# EAGLE design 18f45502 (EAGLE 7.1.0)
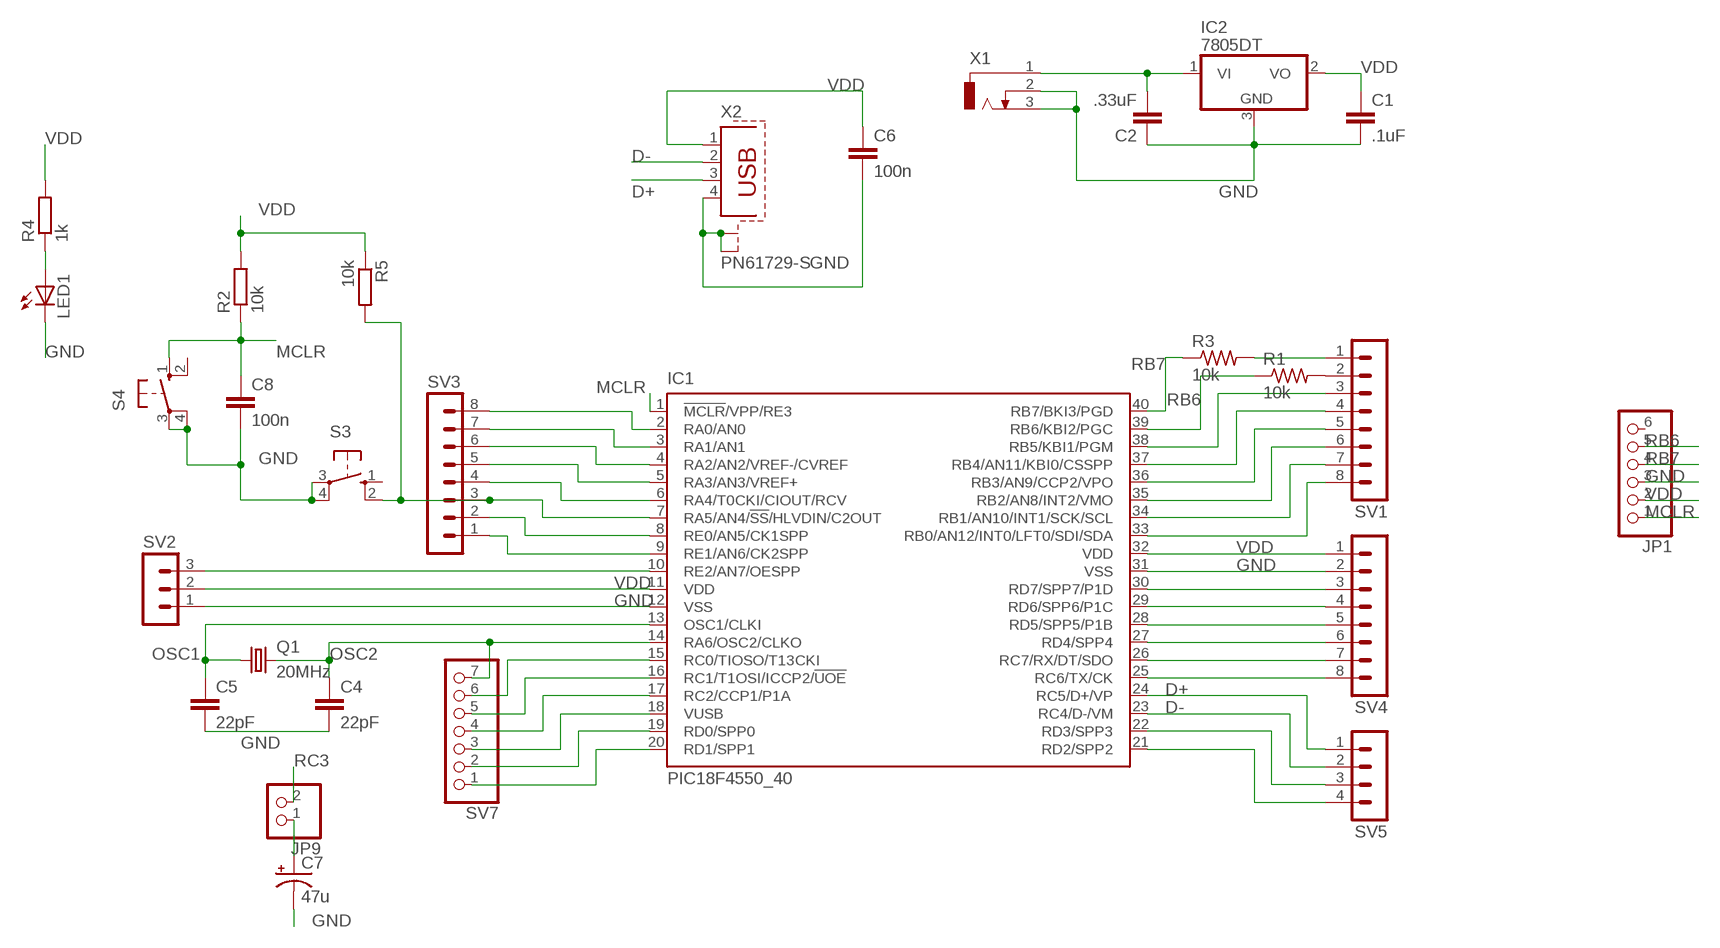
[diagram p0: schematic, sheet 1]

## Parts
C1  .1uF  C-EUC0805K  [C0805K]
C2  .33uF  C-EUC0805K  [C0805K]
C4  22pF  C-EUC0805K  [C0805K]
C5  22pF  C-EUC0805K  [C0805K]
C6  100n  C-EUC0805K  [C0805K]
C7  47u  CPOL-USTT2D5L  [TT2D5L]
C8  100n  C-EUC0805K  [C0805K]
IC1  PIC18F4550_40  [DIL40]
IC2  7805DT  [TO252]
JP1  PINHD-1X6  [1X06]
JP9  PINHD-1X2  [1X02]
LED1  LED3MM  [LED3MM]
Q1  20MHz  CRYSTALHC49S  [HC49/S]
R1  10k  R-US_R0805  [R0805]
R2  10k  R-EU_R0805  [R0805]
R3  10k  R-US_R0805  [R0805]
R4  1k  R-EU_R0805  [R0805]
R5  10k  R-EU_R0805  [R0805]
S3  10-XX  [B3F-10XX]
S4  10-XX  [B3F-10XX]
SV1  MA08-1  [MA08-1]
SV2  MA03-1  [MA03-1]
SV3  MA08-1  [MA08-1]
SV4  MA08-1  [MA08-1]
SV5  MA04-1  [MA04-1]
SV7  PINHD-1X7  [1X07]
X1  DCJ0202  [DCJ0202]
X2  PN61729-S  [PN61729-S]

## Nets
D+: IC1.24(RC5/D+/VP) SV5.1 X2.3
D-: IC1.23(RC4/D-/VM) SV5.2 X2.2
GND: C1.2 C2.1 C4.2 C5.2 C6.2 C7.- C8.2 IC1.12(VSS) IC1.31(VSS) IC2.3(GND) JP1.3 LED1.K(C) S3.3(P) S3.4(P1) S4.3(P) S4.4(P1) SV2.1 SV4.2 X1.2 X1.3 X2.4 X2.S1 X2.S2
MCLR: C8.1 IC1.1(!MCLR!/VPP/RE3) JP1.1 R2.1 S4.1(S)
N$1: R3.2 SV1.1
N$2: R1.2 SV1.2
N$3: IC1.38(RB5/KBI1/PGM) SV1.3
N$4: IC1.37(RB4/AN11/KBI0/CSSPP) SV1.4
N$5: IC1.36(RB3/AN9/CCP2/VPO) SV1.5
N$6: IC1.35(RB2/AN8/INT2/VMO) SV1.6
N$7: IC1.34(RB1/AN10/INT1/SCK/SCL) SV1.7
N$8: IC1.33(RB0/AN12/INT0/LFT0/SDI/SDA) SV1.8
N$9: IC1.30(RD7/SPP7/P1D) SV4.3
N$10: IC1.29(RD6/SPP6/P1C) SV4.4
N$11: IC1.28(RD5/SPP5/P1B) SV4.5
N$12: IC1.27(RD4/SPP4) SV4.6
N$13: IC1.2(RA0/AN0) SV3.8
N$14: IC1.3(RA1/AN1) SV3.7
N$15: IC1.4(RA2/AN2/VREF-/CVREF) SV3.6
N$16: IC1.5(RA3/AN3/VREF+) SV3.5
N$17: IC1.6(RA4/T0CKI/CIOUT/RCV) SV3.4
N$18: IC1.7(RA5/AN4/!SS!/HLVDIN/C2OUT) R5.2 S3.2(S1) SV3.3
N$19: IC1.10(RE2/AN7/OESPP) SV2.3
N$20: IC1.9(RE1/AN6/CK2SPP) SV3.1
N$21: IC1.8(RE0/AN5/CK1SPP) SV3.2
N$24: IC1.21(RD2/SPP2) SV5.4
N$25: IC1.22(RD3/SPP3) SV5.3
N$26: IC1.15(RC0/TIOSO/T13CKI) SV7.6
N$27: IC1.16(RC1/T1OSI/ICCP2/!UOE) SV7.5
N$28: IC1.17(RC2/CCP1/P1A) SV7.4
N$30: IC1.26(RC7/RX/DT/SDO) SV4.7
N$31: IC1.25(RC6/TX/CK) SV4.8
N$32: IC1.19(RD0/SPP0) SV7.2
N$33: IC1.20(RD1/SPP1) SV7.1
N$39: LED1.A R4.1
N$41: C2.2 IC2.1(VI) X1.1
N$46: C7.+ JP9.1
OSC1: C5.1 IC1.13(OSC1/CLKI) Q1.1
OSC2: C4.1 IC1.14(RA6/OSC2/CLKO) Q1.2 SV7.7
RB6: IC1.39(RB6/KBI2/PGC) JP1.5 R1.1
RB7: IC1.40(RB7/BKI3/PGD) JP1.4 R3.1
RC3: IC1.18(VUSB) JP9.2 SV7.3
VDD: C1.1 C6.1 IC1.11(VDD) IC1.32(VDD) IC2.2(VO) JP1.2 R2.2 R4.2 R5.1 SV2.2 SV4.1 X2.1
Unconnected: JP1.6 S3.1(S) S4.2(S1)

## Library data of the parts
C1 C2 C4-C6 C8 = resistor:C-EU: CAPACITOR, European symbol
C7 = rcl:CPOL-US: POLARIZED CAPACITOR, American symbol
IC1 = microchip:PIC18F4*_40: USB Microcontrollers with nanoWatt Technology High-Performance, Enhanced Flash, 28/40/44-Pin, Source: http://ww1.microchip.com/downloads/en/devicedoc/39632c.pdf
IC2 = linear:78*: Positive VOLTAGE REGULATOR Source: http://cache.national.com/ds/LM/LM78L05.pdf http://www.fairchildsemi.com/ds/LM/LM7805.pdf
JP1 = pinhead:PINHD-1X6: PIN HEADER
JP9 = pinhead:PINHD-1X2: PIN HEADER
LED1 = led:LED: LED OSRAM: - CHIPLED LG R971, LG N971, LY N971, LG Q971, LY Q971, LO R971, LY R971 LH N974, LH R974 LS Q976, LO Q976, LY Q976 LO Q996 - Hyper CHIPLED LW Q18S LB Q993, LB Q99A, LB R99A - SideLED LS A670, LO A670, LY A670, LG A670, LP A670 LB A673, LV A673, LT A673, LW A673 LH A674 LY A675 LS A676, LA A676, LO A676, LY A676, LW A676 LS A679, LY A679, LG A679 - Hyper Micro SIDELED® LS Y876, LA Y876, LO Y876, LY Y876 LT Y87S - SmartLED LW L88C, LW L88S LB L89C, LB L89S, LG L890 LS L89K, LO L89K, LY L89K LS L896, LA L896, LO L896, LY L896 - TOPLED LS T670, LO T670, LY T670, LG T670, LP T670 LSG T670, LSP T670, LSY T670, LOP T670, LYG T670 LG T671, LOG T671, LSG T671 LB T673, LV T673, LT T673, LW T673 LH T674 LS T676, LA T676, LO T676, LY T676, LB T676, LH T676, LSB T676, LW T676 LB T67C, LV T67C, LT T67C, LS T67K, LO T67K, LY T67K, LW E67C LS E67B, LA E67B, LO E67B, LY E67B, LB E67C, LV E67C, LT E67C LW T67C LS T679, LY T679, LG T679 LS T770, LO T770, LY T770, LG T770, LP T770 LB T773, LV T773, LT T773, LW T773 LH T774 LS E675, LA E675, LY E675, LS T675 LS T776, LA T776, LO T776, LY T776, LB T776 LHGB T686 LT T68C, LB T68C - Hyper Mini TOPLED® LB M676 - Mini TOPLED Santana® LG M470 LS M47K, LO M47K, LY M47K Source: http://www.osram.convergy.de LUXEON: - LUMILED® LXK2-PW12-R00, LXK2-PW12-S00, LXK2-PW14-U00, LXK2-PW14-V00 LXK2-PM12-R00, LXK2-PM12-S00, LXK2-PM14-U00 LXK2-PE12-Q00, LXK2-PE12-R00, LXK2-PE12-S00, LXK2-PE14-T00, LXK2-PE14-U00 LXK2-PB12-K00, LXK2-PB12-L00, LXK2-PB12-M00, LXK2-PB14-N00, LXK2-PB14-P00, LXK2-PB14-Q00 LXK2-PR12-L00, LXK2-PR12-M00, LXK2-PR14-Q00, LXK2-PR14-R00 LXK2-PD12-Q00, LXK2-PD12-R00, LXK2-PD12-S00 LXK2-PH12-R00, LXK2-PH12-S00 LXK2-PL12-P00, LXK2-PL12-Q00, LXK2-PL12-R00 Source: www.luxeon.com KINGBRIGHT: KA-3528ASYC Source: www.kingbright.com
Q1 = crystal:CRYSTAL: CRYSTAL
R1 R3 = resistor:R-US_: RESISTOR, American symbol
R2 R4 R5 = resistor:R-EU_: RESISTOR, European symbol
S3 S4 = switch-omron:10-XX: OMRON SWITCH; MPN: B3F-1000; OC_FARNELL: 176432; OC_NEWARK: 36M3542
SV1 SV3 SV4 = con-lstb:MA08-1: PIN HEADER; OC_FARNELL: unknown; OC_NEWARK: unknown
SV2 = con-lstb:MA03-1: PIN HEADER; OC_FARNELL: unknown; OC_NEWARK: unknown
SV5 = con-lstb:MA04-1: PIN HEADER; OC_FARNELL: unknown; OC_NEWARK: unknown
SV7 = pinhead:PINHD-1X7: PIN HEADER
X1 = con-jack:DCJ0202: DC POWER JACK Source: DCJ0202.pdf; OC_FARNELL: unknown; OC_NEWARK: unknown
X2 = con-berg:PN61729-S: BERG USB connector; OC_FARNELL: unknown; OC_NEWARK: unknown

## Board
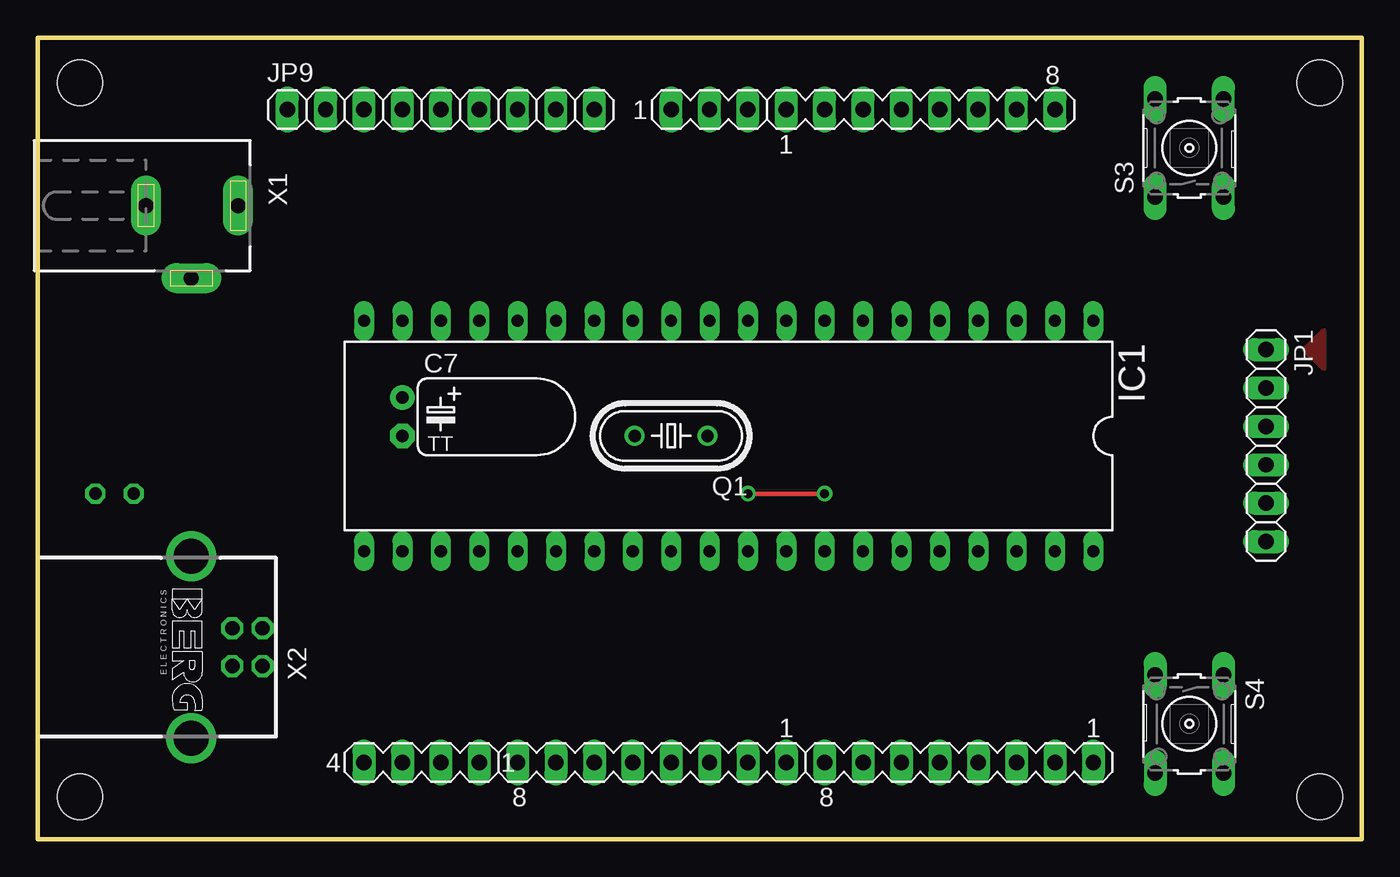
[diagram p1: board, top side]
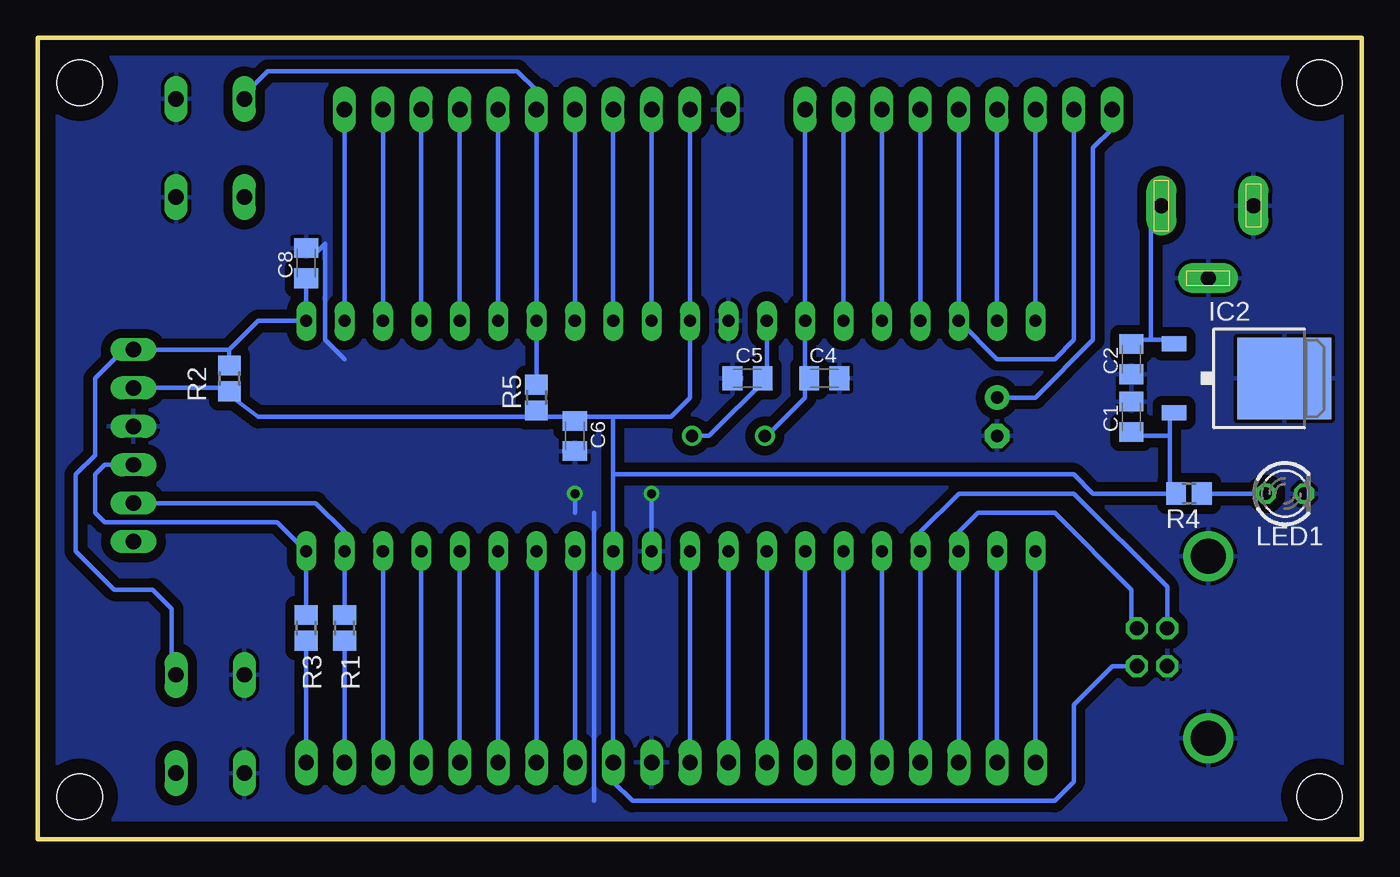
[diagram p2: board, bottom side, seen from below]

Size 87.61 x 53.01 mm. Coordinates in mm from the lower left corner, seen from the top.
Outline: 0,0 87.61,0 87.61,53.01 0,53.01 0,0
Copper layers (1*16): Top 0.035mm / dielectric 1.5mm / Bottom 0.035mm
Design rules "default": minimum track width 10mil, minimum drill 24mil, track to track 8mil, track to pad 8mil, pad to pad 8mil, via to via 8mil, smd to smd 8mil, copper to edge 40mil, drill to drill 8mil, minimum pad ring 10mil, minimum via ring 8mil, stop-mask expansion 4mil, vias tented up to drill 0mil, thermal gap 10mil
Holes 3 mm at 2.79,50.04 2.79,2.79 84.84,50.04 84.84,2.79

### Footprints (pad centres in the part's own frame; a part is rotated, then mirrored left to right if it is on the bottom)
C0805K = smd 1.3 x 1.6: 1 -1,0; 2 1,0
TT2D5L = drill 0.813 pad 1.6: + -1.27,0 | drill 0.813 pad 1.6 octagon: - 1.27,0
DIL40 = drill 0.813 long: 1 -24.13,-7.62; 2 -21.59,-7.62; 3 -19.05,-7.62; 4 -16.51,-7.62; 5 -13.97,-7.62; 6 -11.43,-7.62; 7 -8.89,-7.62; 8 -6.35,-7.62; 9 -3.81,-7.62; 10 -1.27,-7.62; 11 1.27,-7.62; 12 3.81,-7.62; 13 6.35,-7.62; 14 8.89,-7.62; 15 11.43,-7.62; 16 13.97,-7.62; 17 16.51,-7.62; 18 19.05,-7.62; 19 21.59,-7.62; 20 24.13,-7.62; 21 24.13,7.62; 22 21.59,7.62; 23 19.05,7.62; 24 16.51,7.62; 25 13.97,7.62; 26 11.43,7.62; 27 8.89,7.62; 28 6.35,7.62; 29 3.81,7.62; 30 1.27,7.62; 31 -1.27,7.62; 32 -3.81,7.62; 33 -6.35,7.62; 34 -8.89,7.62; 35 -11.43,7.62; 36 -13.97,7.62; 37 -16.51,7.62; 38 -19.05,7.62; 39 -21.59,7.62; 40 -24.13,7.62
TO252 = smd 1 x 1.6: 1 -2.28,-4.8; 2 2.28,-4.8 | smd 5.4 x 6.2: 3 0,2.5
1X06 = drill 1.016 long: 1 -6.35,0; 2 -3.81,0; 3 -1.27,0; 4 1.27,0; 5 3.81,0; 6 6.35,0
1X02 = drill 1.016 long: 1 -1.27,0; 2 1.27,0
LED3MM = drill 0.813 octagon: A -1.27,0; K 1.27,0
HC49/S = drill 0.813: 1 -2.413,0; 2 2.413,0
R0805 = smd 1.3 x 1.5: 1 -0.85,0; 2 0.85,0
B3F-10XX = drill 1.016 long: 1 -3.251,2.261; 2 3.251,2.261; 3 -3.251,-2.261; 4 3.251,-2.261
MA08-1 = drill 1.016 long: 1 -8.89,0; 2 -6.35,0; 3 -3.81,0; 4 -1.27,0; 5 1.27,0; 6 3.81,0; 7 6.35,0; 8 8.89,0
MA03-1 = drill 1.016 long: 1 -2.54,0; 2 0,0; 3 2.54,0
MA04-1 = drill 1.016 long: 1 -3.81,0; 2 -1.27,0; 3 1.27,0; 4 3.81,0
1X07 = drill 1.016 long: 1 -7.62,0; 2 -5.08,0; 3 -2.54,0; 4 0,0; 5 2.54,0; 6 5.08,0; 7 7.62,0
DCJ0202 = drill 1 pad 2 long: 1 0,3.1; 2 4.8,0; 3 0,-3
PN61729-S = drill 0.95 octagon: 1 1.25,4.71; 2 -1.25,4.71; 3 -1.25,2.71; 4 1.25,2.71 | drill 2.3 pad 2.9: S1 -6.02,0; S2 6.02,0

### Placement (x,y rotation side)
C1  15.24,27.94 90 bottom
C2  15.24,31.75 90 bottom
C4  35.56,30.48 0 bottom
C5  40.64,30.48 180 bottom
C6  52.07,26.67 270 bottom
C7  24.13,27.94 270 top
C8  69.85,38.1 90 bottom
IC1  45.72,26.67 180 top
IC2  7.62,30.48 270 bottom
JP1  81.28,26.04 270 top
JP9  17.78,48.26 0 top
LED1  5.08,22.86 0 bottom
Q1  41.91,26.67 180 top
R1  67.31,13.97 270 bottom
R2  74.93,30.48 270 bottom
R3  69.85,13.97 270 bottom
R4  11.43,22.86 180 bottom
R5  54.61,29.21 90 bottom
S3  76.2,45.72 90 top
S4  76.2,7.62 270 top
SV1  60.96,5.08 180 top
SV2  44.45,48.26 0 top
SV3  58.42,48.26 0 top
SV4  40.64,5.08 180 top
SV5  25.4,5.08 180 top
SV7  29.21,48.26 0 top
X1  10.16,41.91 270 top
X2  10.16,12.7 270 top

### Tracks (layer width: path | path; a pad name or v marks a point on that pad's centre or on a via)
D+
  Bottom 0.305: SV5.1 IC1.24 29.21,20.32 26.67,22.86 19.05,22.86 12.87,16.68 X2.3
D-
  Bottom 0.305: SV5.2 IC1.23 26.67,20.32 25.4,21.59 20.32,21.59 15.24,16.51 15.24,14.32 X2.2
GND  (via drill 0.6)
  Top 0.305: v46.99,22.86 v52.07,22.86
  Bottom 0.305: C8.2 69.23,38.75 68.58,39.37 68.58,33.02 67.31,31.75 | 50.8,2.54 50.8,21.59 | v52.07,22.86 52.07,21.59 | v46.99,22.86 IC1.31
  pour Bottom (isolate 0.61): 87.63,53.34 0,53.34 0,0 87.63,0
MCLR
  Bottom 0.305: C8.1 IC1.1 73.03,34.29 74.93,32.38 | 74.93,32.38 JP1.1 81.92,32.38 83.82,30.48 83.82,25.4 85.09,24.13 85.09,19.05 82.55,16.51 80.01,16.51 78.74,15.24 78.74,11.15 S4.1 | 74.93,32.38 R2.1
N$1
  Bottom 0.305: SV1.1 R3.2
N$2
  Bottom 0.305: SV1.2 R1.2
N$3
  Bottom 0.305: SV1.3 IC1.38
N$4
  Bottom 0.305: SV1.4 IC1.37
N$5
  Bottom 0.305: SV1.5 IC1.36
N$6
  Bottom 0.305: SV1.6 IC1.35
N$7
  Bottom 0.305: SV1.7 IC1.34
N$8
  Bottom 0.305: SV1.8 IC1.33
N$9
  Bottom 0.305: SV4.3 IC1.30
N$10
  Bottom 0.305: SV4.4 IC1.29
N$11
  Bottom 0.305: SV4.5 IC1.28
N$12
  Bottom 0.305: SV4.6 IC1.27
N$13
  Bottom 0.305: IC1.2 SV3.8
N$14
  Bottom 0.305: IC1.3 SV3.7
N$15
  Bottom 0.305: IC1.4 SV3.6
N$16
  Bottom 0.305: IC1.5 SV3.5
N$17
  Bottom 0.305: IC1.6 SV3.4
N$18
  Bottom 0.305: S3.2 73.66,49.53 72.39,50.8 55.88,50.8 54.61,49.53 SV3.3 IC1.7 R5.2
N$19
  Bottom 0.305: IC1.10 SV2.3
N$20
  Bottom 0.305: IC1.9 SV3.1
N$21
  Bottom 0.305: IC1.8 SV3.2
N$23
  pour Top: 83.82,32.38 85.09,31.11 85.09,33.66
N$24
  Bottom 0.305: SV5.4 IC1.21
N$25
  Bottom 0.305: SV5.3 IC1.22
N$26
  Bottom 0.305: IC1.15 SV7.6
N$27
  Bottom 0.305: IC1.16 SV7.5
N$28
  Bottom 0.305: IC1.17 SV7.4
N$30
  Bottom 0.305: SV4.7 IC1.26
N$31
  Bottom 0.305: SV4.8 IC1.25
N$32
  Bottom 0.305: IC1.19 SV7.2
N$33
  Bottom 0.305: IC1.20 SV7.1
N$39
  Bottom 0.305: R4.1 LED1.A
N$41
  Bottom 0.305: X1.1 13.97,40.64 13.97,33.02 | 13.97,33.02 15.24,33.02 C2.2 | 13.97,33.02 12.7,33.02 IC2.1
N$46
  Bottom 0.305: C7.+ 21.59,29.21 17.78,33.02 17.78,45.72 16.51,46.99 JP9.1
OSC1
  Bottom 0.305: Q1.1 43.18,26.67 39.37,30.48 C5.1 39.37,30.75 IC1.13
OSC2
  Bottom 0.305: 36.83,30.48 IC1.14 SV7.7 | 36.83,30.48 C4.1 | Q1.2 39.37,26.67 36.83,29.21 36.83,30.48
RB6
  Bottom 0.305: JP1.5 69.22,22.23 67.31,20.32 IC1.39 R1.1
RB7
  Bottom 0.305: 80.01,24.77 JP1.4 83.19,24.77 83.82,24.13 83.82,21.59 83.19,20.95 71.75,20.95 IC1.40 R3.1
RC3
  Bottom 0.305: SV7.3 IC1.18 24.13,31.75 20.32,31.75 19.05,33.02 JP9.2
VDD
  Bottom 0.305: SV2.2 IC1.11 44.45,29.21 45.72,27.94 49.53,27.94 | X2.1 16.49,11.45 19.05,8.89 19.05,3.81 20.32,2.54 48.26,2.54 49.53,3.81 SV4.1 IC1.32 49.53,24.13 | 49.53,24.13 49.53,27.94 | 49.53,27.94 52.07,27.94 | 52.07,27.94 54.61,27.94 | 54.61,27.94 73.03,27.94 75.56,29.84 | 75.56,29.84 JP1.2 | 75.56,29.84 R2.2 | C1.1 15.24,26.67 12.7,26.67 | 12.7,26.67 12.7,27.94 IC2.2 | R4.2 12.7,22.86 | 12.7,22.86 12.7,26.67 | 12.7,22.86 17.78,22.86 19.05,24.13 49.53,24.13 | C6.1 52.07,27.94 | R5.1 54.61,27.94